# EAGLE design DualPowerSupply (EAGLE 9.6.2)
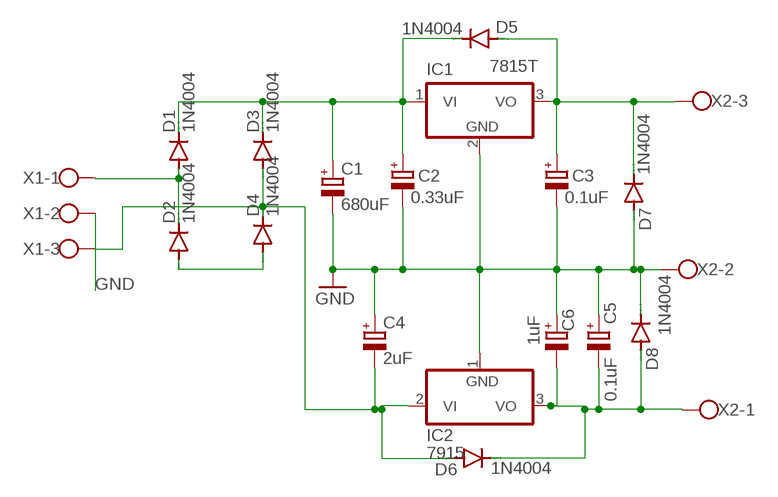
[diagram p0: schematic, sheet 1]

## Parts
C1  680uF  CPOL-EUB45181B  [B45181B]
C2  0.33uF  CPOL-EUE2-4  [E2-4]
C3  0.1uF  CPOL-EUE2-4  [E2-4]
C4  2uF  CPOL-EUE2-4  [E2-4]
C5  0.1uF  CPOL-EUE2-4  [E2-4]
C6  1uF  CPOL-EUE2-4  [E2-4]
D1  1N4004  [DO41-10]
D2  1N4004  [DO41-10]
D3  1N4004  [DO41-10]
D4  1N4004  [DO41-10]
D5  1N4004  [DO41-10]
D6  1N4004  [DO41-10]
D7  1N4004  [DO41-10]
D8  1N4004  [DO41-10]
IC1  7815T  [TO220H]
IC2  7915  7915T  [TO220H]
X1  W237-103  [W237-103]
X2  W237-103  [W237-103]

## Nets
GND: C1.- C2.- C3.- C4.+ C5.+ C6.+ D7.A D8.C IC1.2(GND) IC2.1(GND) X1.2 X2.2
N$1: C3.+ D5.A D7.C IC1.3(VO) X2.3
N$2: C1.+ C2.+ D1.C D3.C D5.C IC1.1(VI)
N$3: C4.- D3.A D4.C D6.A IC2.2(VI) X1.3
N$4: D2.A D4.A
N$5: D1.A D2.C X1.1
N$7: C5.- C6.- D6.C D8.A IC2.3(VO) X2.1

## Library data of the parts
C1-C6 = rcl:CPOL-EU: POLARIZED CAPACITOR, European symbol; SPICEPREFIX: C
D1-D8 = diode:1N4004: DIODE general purpose rectifier, 1 A
IC1 = linear:78*: Positive VOLTAGE REGULATOR Source: http://cache.national.com/ds/LM/LM78L05.pdf http://www.fairchildsemi.com/ds/LM/LM7805.pdf
IC2 = linear:79*: Negative VOLTAGE REGULATOR
X1 X2 = con-wago-500:W237-103: WAGO SCREW CLAMP; MPN: 237-103; OC_FARNELL: unknown; OC_NEWARK: 18M7116

## Board
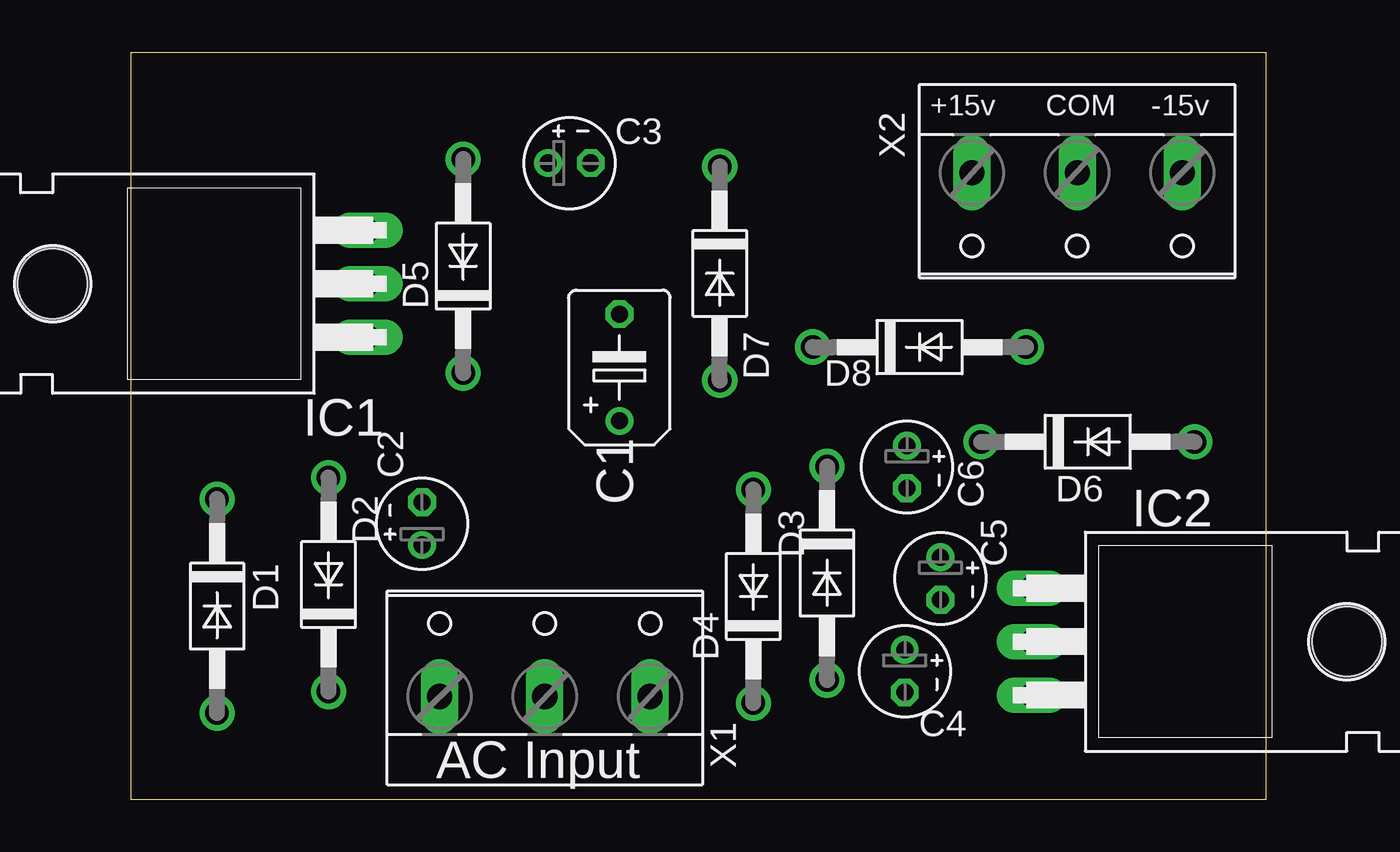
[diagram p1: board, top side]
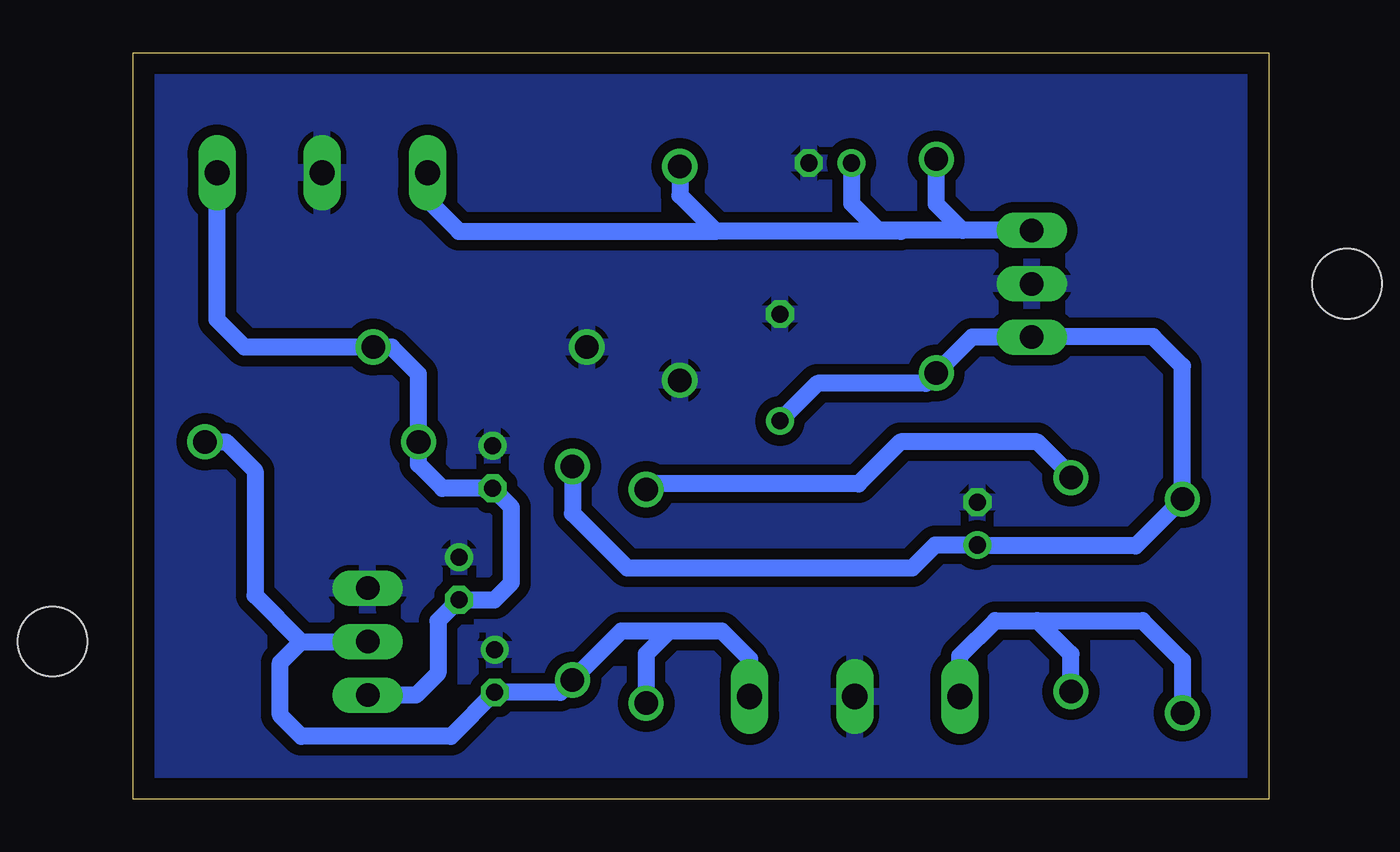
[diagram p2: board, bottom side, seen from below]

Size 54 x 35.5 mm. Coordinates in mm from the lower left corner, seen from the top.
Outline: 54,0 54,35.5 0,35.5 0,0 54,0
Copper layers (1*16): Top 0.035mm / dielectric 1.5mm / Bottom 0.035mm
Design rules "default *": minimum track width 6mil, minimum drill 0.35mm, track to track 20mil, track to pad 20mil, pad to pad 20mil, via to via 20mil, smd to smd 6mil, copper to edge 40mil, drill to drill 6mil, minimum pad ring 10mil, minimum via ring 8mil, stop-mask expansion 4mil, vias tented up to drill 0mil, thermal gap 10mil

### Footprints (pad centres in the part's own frame; a part is rotated, then mirrored left to right if it is on the bottom)
B45181B = drill 0.813: + -2.54,0 | drill 0.813 octagon: - 2.54,0
E2-4 = drill 0.813 pad 1.27: + -1.016,0 | drill 0.813 pad 1.27 octagon: - 1.016,0
DO41-10 = drill 1.118: A 5.08,0; C -5.08,0
TO220H = drill 1.118 long: 1 -2.54,-10.16; 2 0,-10.16; 3 2.54,-10.16 | hole 3.302: 0,4.826
W237-103 = drill 1.194 long: 1 -5,-1.29; 2 0,-1.29; 3 5,-1.29

### Placement (x,y rotation side)
C1  23.23,20.53 90 top
C2  13.85,13.11 90 top
C3  20.85,30.25 0 top
C4  36.8,6.1 270 top
C5  38.5,10.5 270 top
C6  36.9,15.8 270 top
D1  4.1,9.19 270 top
D2  9.4,10.21 90 top
D3  33.1,10.75 270 top
D4  29.6,9.65 90 top
D5  15.8,25.35 90 top
D6  45.5,17 0 top
D7  28,25 270 top
D8  37.5,21.5 0 top
IC1  1.1,24.51 90 top
IC2  53,7.5 270 top
X1  19.68,6.18 0 top
X2  45,28.5 180 top

### Tracks (layer width: path | path; a pad name or v marks a point on that pad's centre or on a via)
GND
  pour Bottom: 1,1 1,34.5 53,34.5 53,1
N$1
  Bottom 0.813: 26.28,27 28,28.72 D7.C | C3.+ 19.83,28.33 18.55,27.05 17.55,27.05 | 17.55,27.05 17.5,27 26.28,27 | D5.A 15.8,28.3 14.55,27.05 | 14.55,27.05 17.55,27.05 | IC1.3 14.55,27.05 | X2.3 40,28.5 38.5,27 26.28,27
N$2
  Bottom 0.813: D3.C 33.1,13.6 30.5,11 16.94,11 15.85,12.09 C2.+ 13.81,12.05 6.32,12.05 D1.C 4.1,20.6 5.5,22 11.23,22 IC1.1 14.1,21.97 D5.C 16.3,19.77 21.45,19.77 C1.+
N$3
  Bottom 0.813: D6.A 49.58,17 48.2,15.62 48.2,9.7 46,7.5 | 46,7.5 IC2.2 | 46,7.5 47,6.5 47,4 46,3 38.88,3 C4.- 33.69,5.08 D3.A 33.1,5.69 30.79,8 28.5,8 | X1.3 24.68,6.68 26,8 28.5,8 | 28.5,8 29.6,6.9 D4.C
N$4
  Bottom 0.813: D4.A 29.33,15 19.5,15 17.5,17 11,17 9.4,15.4 D2.A
N$5
  Bottom 0.813: X1.1 14.68,6.82 13,8.5 11,8.5 | 11,8.5 6,8.5 4.1,6.6 D1.A | D2.C 9.4,6.9 11,8.5
N$7
  Bottom 0.813: IC2.3 40.54,4.96 39.5,6 39.5,8.48 C5.- 36.82,9.48 36,10.3 36,13.88 C6.- 39.28,14.78 40.42,15.92 D6.C 40.42,20.22 41.7,21.5 D8.A 48.7,21.5 50,22.8 X2.1

### Text on the board
tNames: +15v | COM | -15v | AC Input